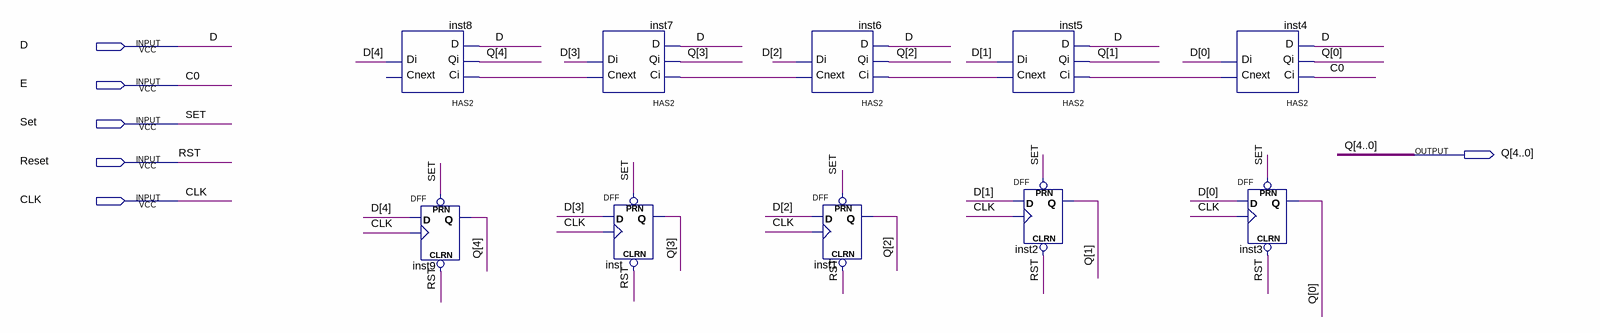
[diagram p0: schematic sheet]
// Quartus schematic CounterUp_Down.bdf as structural Verilog: 10 symbols, 6 pins
module CounterUp_Down (
  input  D,
  input  E,
  input  Set,
  input  Reset,
  input  CLK,
  output [4:0] Q
);

  wire inst4_cnext, inst5_cnext, inst6_cnext, inst7_cnext;
  wire [4:0] D_bus;

  HAS2 inst8 (.D(D), .Qi(Q[4]), .Ci(inst7_cnext), .Di(D_bus[4]));  // open: Cnext
  DFF inst9 (.CLRN(Reset), .CLK(CLK), .D(D_bus[4]), .PRN(Set), .Q(Q[4]));
  HAS2 inst7 (.D(D), .Qi(Q[3]), .Ci(inst6_cnext), .Cnext(inst7_cnext), .Di(D_bus[3]));
  DFF inst (.CLRN(Reset), .CLK(CLK), .D(D_bus[3]), .PRN(Set), .Q(Q[3]));
  HAS2 inst6 (.D(D), .Qi(Q[2]), .Ci(inst5_cnext), .Cnext(inst6_cnext), .Di(D_bus[2]));
  DFF inst1 (.CLRN(Reset), .CLK(CLK), .D(D_bus[2]), .PRN(Set), .Q(Q[2]));
  HAS2 inst5 (.D(D), .Qi(Q[1]), .Ci(inst4_cnext), .Cnext(inst5_cnext), .Di(D_bus[1]));
  DFF inst2 (.CLRN(Reset), .CLK(CLK), .D(D_bus[1]), .PRN(Set), .Q(Q[1]));
  HAS2 inst4 (.D(D), .Qi(Q[0]), .Ci(E), .Cnext(inst4_cnext), .Di(D_bus[0]));
  DFF inst3 (.CLRN(Reset), .CLK(CLK), .D(D_bus[0]), .PRN(Set), .Q(Q[0]));

  // Other names for the same wires on the sheet: C0 = E; RST = Reset
endmodule
